# EAGLE schematic version_1_1 (EAGLE 7.6.0)
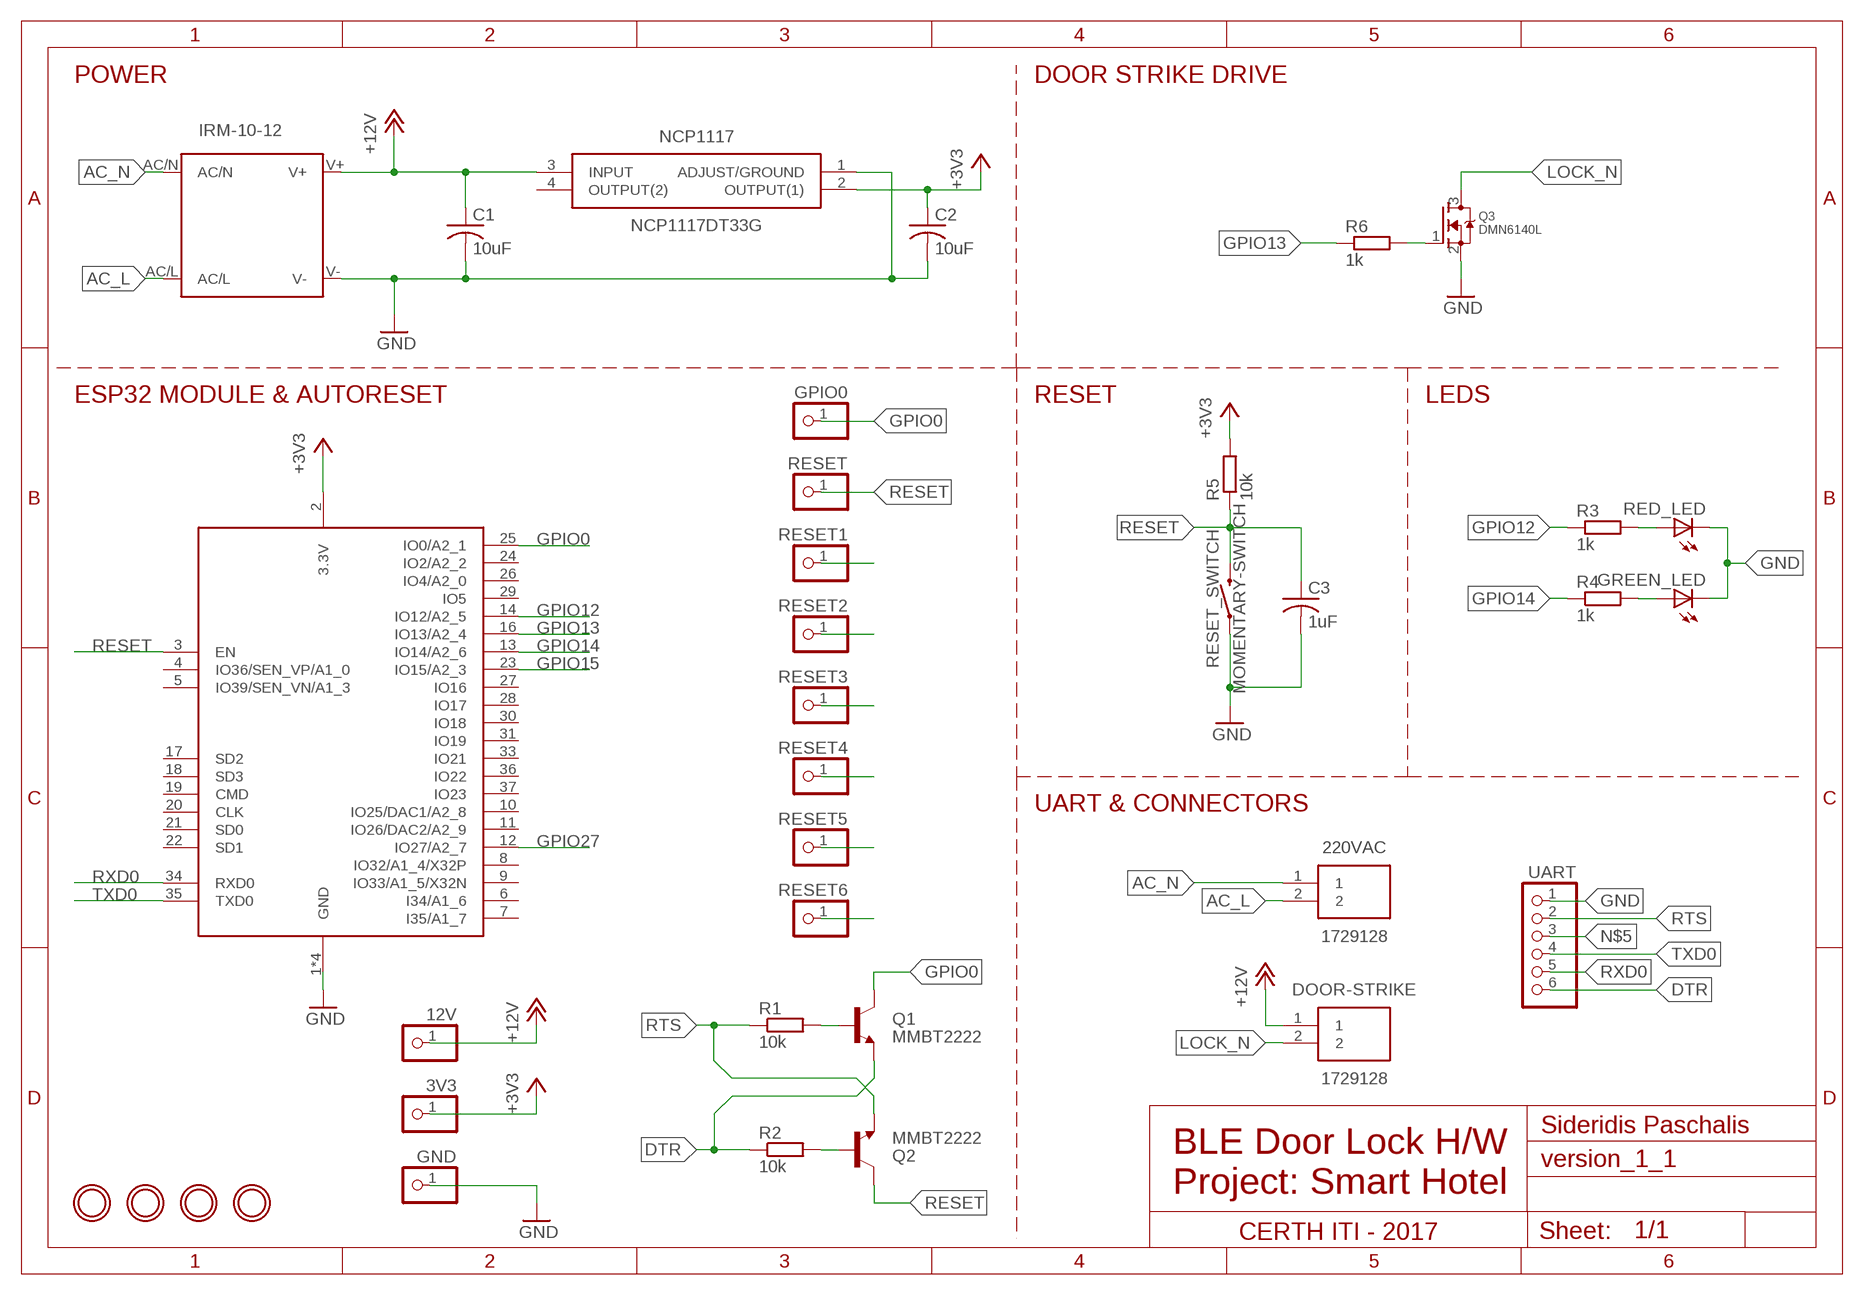
[diagram p0: schematic, sheet 1]

## Parts
3V3  PINHD-1X1  [1X01]
12V  PINHD-1X1  [1X01]
220VAC  1729128  [HDRV2W110P0X508_1X2_1016X810X1]
C1  10uF  C-USC0805  [C0805]
C2  10uF  C-USC0805  [C0805]
C3  1uF  C-USC0805  [C0805]
DOOR-STRIKE  1729128  [HDRV2W110P0X508_1X2_1016X810X1]
ESP32  ESP32_WROOM32_SKINNY  [WROOM32_SKINNY]
GND  PINHD-1X1  [1X01]
GPIO0  PINHD-1X1  [1X01]
GREEN_LED  LED5MM  [LED5MM]
IRM-10-12  IRM_05/10  [IRM_05/10]
NCP1117  NCP1117DT33G  [TO229P990X238-4N]
Q1  MMBT2222  TRANSISTOR_NPNSOT23  [SOT23]
Q2  MMBT2222  TRANSISTOR_NPNSOT23  [SOT23]
Q3  DMN6140L  MOSFET-NREFLOW  [SOT23]
R1  10k  R-EU_R0805  [R0805]
R2  10k  R-EU_R0805  [R0805]
R3  1k  R-EU_R0805  [R0805]
R4  1k  R-EU_R0805  [R0805]
R5  10k  R-EU_R0805  [R0805]
R6  1k  R-EU_R0805  [R0805]
RED_LED  LED5MM  [LED5MM]
RESET  PINHD-1X1  [1X01]
RESET1  PINHD-1X1  [1X01]
RESET2  PINHD-1X1  [1X01]
RESET3  PINHD-1X1  [1X01]
RESET4  PINHD-1X1  [1X01]
RESET5  PINHD-1X1  [1X01]
RESET6  PINHD-1X1  [1X01]
RESET_SWITCH  MOMENTARY-SWITCH  MOMENTARY-SWITCH-SPST-SMD-6.2MM-TALL  [TACTILE_SWITCH_SMD_6.2MM_TALL]
U$1  MOUNTINGHOLE2.5  [MOUNTINGHOLE_2.5_PLATED]
U$2  MOUNTINGHOLE2.5  [MOUNTINGHOLE_2.5_PLATED]
U$3  MOUNTINGHOLE2.5  [MOUNTINGHOLE_2.5_PLATED]
U$4  MOUNTINGHOLE2.5  [MOUNTINGHOLE_2.5_PLATED]
UART  PINHD-1X6  [1X06]

## Nets
+3V3: 3V3.1 C2.1 ESP32.2(3.3V) NCP1117.2(OUTPUT(1)) R5.2
+12V: 12V.1 C1.1 DOOR-STRIKE.1 IRM-10-12.V+ NCP1117.3(INPUT)
AC_L: 220VAC.2 IRM-10-12.AC/L
AC_N: 220VAC.1 IRM-10-12.AC/N
DTR: Q1.2(E) R2.1 UART.6
GND: C1.2 C2.2 C3.2 ESP32.1(GND) ESP32.15(GND) ESP32.38(GND) ESP32.P$1(GND) GND.1 GREEN_LED.K(C) IRM-10-12.V- NCP1117.1(ADJUST/GROUND) Q3.2(S) RED_LED.K(C) RESET_SWITCH.A2 UART.1
GPIO0: ESP32.25(IO0/A2_1) GPIO0.1 Q1.3(C)
GPIO12: ESP32.14(IO12/A2_5) R3.1
GPIO13: ESP32.16(IO13/A2_4) R6.1
GPIO14: ESP32.13(IO14/A2_6) R4.1
GPIO15: ESP32.23(IO15/A2_3)
GPIO27: ESP32.12(IO27/A2_7)
LOCK_N: DOOR-STRIKE.2 Q3.3(D)
N$1: R3.2 RED_LED.A
N$2: Q1.1(B) R1.2
N$3: Q2.1(B) R2.2
N$4: GREEN_LED.A R4.2
N$5: UART.3
N$6: Q3.1(G) R6.2
N$7: RESET1.1
N$8: RESET2.1
N$9: RESET3.1
N$10: RESET4.1
N$11: RESET5.1
N$12: RESET6.1
RESET: C3.1 ESP32.3(EN) Q2.3(C) R5.1 RESET.1 RESET_SWITCH.B2
RTS: Q2.2(E) R1.1 UART.2
RXD0: ESP32.34(RXD0) UART.5
TXD0: ESP32.35(TXD0) UART.4
Unconnected: ESP32.4(IO36/SEN_VP/A1_0) ESP32.5(IO39/SEN_VN/A1_3) ESP32.6(I34/A1_6) ESP32.7(I35/A1_7) ESP32.8(IO32/A1_4/X32P) ESP32.9(IO33/A1_5/X32N) ESP32.10(IO25/DAC1/A2_8) ESP32.11(IO26/DAC2/A2_9) ESP32.17(SD2) ESP32.18(SD3) ESP32.19(CMD) ESP32.20(CLK) ESP32.21(SD0) ESP32.22(SD1) ESP32.24(IO2/A2_2) ESP32.26(IO4/A2_0) ESP32.27(IO16) ESP32.28(IO17) ESP32.29(IO5) ESP32.30(IO18) ESP32.31(IO19) ESP32.33(IO21) ESP32.36(IO22) ESP32.37(IO23) NCP1117.4(OUTPUT(2))

## Notes on the sheet
- POWER | DOOR STRIKE DRIVE
- ESP32 MODULE & AUTORESET | RESET | LEDS
- UART & CONNECTORS
- Sideridis Paschalis
- BLE Door Lock H/W
  Project: Smart Hotel
- CERTH ITI - 2017

## Library data of the parts
3V3 12V GND GPIO0 RESET RESET1-RESET6 = adafruit:PINHD-1X1: Pin header 1x1 for 0.1" spacing With round pins
220VAC DOOR-STRIKE = 1729128:1729128: 2way low profile vertical mount terminal Phoenix Contact Non-Fused Terminal Block, 2 Way, Solder Terminals, 30 ??? 14 AWG Through Hole, Nylon, 630 V <https://componentsearchengine.com/Images/1/1729128.jpg> Source: Datasheet <http://docs-europe.electrocomponents.com/webdocs/1380/0900766b81380189.pdf>; ALLIED_NUMBER: 70054405; DESCRIPTION: 2way low profile vertical mount terminal Phoenix Contact Non-Fused Terminal Block, 2 Way, Solder Terminals, 30 ??? 14 AWG Through Hole, Nylon, 630 V; HEIGHT: 10mm; MANUFACTURER_NAME: Phoenix Contact; MANUFACTURER_PART_NUMBER: 1729128; RS_PART_NUMBER: 1930586; SUPPLIER_NAME: RS
C1-C3 = rcl:C-US: CAPACITOR, American symbol
ESP32 = Adafruit HUZZAH32 ESP32 Feather:ESP32_WROOM32
GREEN_LED RED_LED = adafruit:LED: LED OSRAM: - CHIPLED LG R971, LG N971, LY N971, LG Q971, LY Q971, LO R971, LY R971 LH N974, LH R974 LS Q976, LO Q976, LY Q976 LO Q996 - Hyper CHIPLED LW Q18S LB Q993, LB Q99A, LB R99A - SideLED LS A670, LO A670, LY A670, LG A670, LP A670 LB A673, LV A673, LT A673, LW A673 LH A674 LY A675 LS A676, LA A676, LO A676, LY A676, LW A676 LS A679, LY A679, LG A679 - Hyper Micro SIDELED® LS Y876, LA Y876, LO Y876, LY Y876 LT Y87S - SmartLED LW L88C, LW L88S LB L89C, LB L89S, LG L890 LS L89K, LO L89K, LY L89K LS L896, LA L896, LO L896, LY L896 - TOPLED LS T670, LO T670, LY T670, LG T670, LP T670 LSG T670, LSP T670, LSY T670, LOP T670, LYG T670 LG T671, LOG T671, LSG T671 LB T673, LV T673, LT T673, LW T673 LH T674 LS T676, LA T676, LO T676, LY T676, LB T676, LH T676, LSB T676, LW T676 LB T67C, LV T67C, LT T67C, LS T67K, LO T67K, LY T67K, LW E67C LS E67B, LA E67B, LO E67B, LY E67B, LB E67C, LV E67C, LT E67C LW T67C LS T679, LY T679, LG T679 LS T770, LO T770, LY T770, LG T770, LP T770 LB T773, LV T773, LT T773, LW T773 LH T774 LS E675, LA E675, LY E675, LS T675 LS T776, LA T776, LO T776, LY T776, LB T776 LHGB T686 LT T68C, LB T68C - Hyper Mini TOPLED® LB M676 - Mini TOPLED Santana® LG M470 LS M47K, LO M47K, LY M47K Source: http://www.osram.convergy.de/
IRM-10-12 = meanwell_irm_v5:IRM_05/10: 5 or 10 watt housing & pin compatible IRM 05 Vout [V] Imax [A] Pmax [W] Eff [%] 3.3 1.25 4.125 68 5 1 5 71 12 0.42 5.04 75 15 0.33 4.95 75 24 0.23 5.52 77 IRM 10 Vout [V] Imax [A] Pmax [W] Eff [%] 3.3 2.5 8.25 74 5 2 10 77 12 0.85 10.2 82 15 0.67 10.05 82 24 0.42 10.08 82
NCP1117 = NCP1117DT33G:NCP1117DT33G: 1A,3.3V,LDO Voltage Reg.,NCP1117DT33 NCP1117DT33G, Low Dropout Voltage Regulator, 1A, 3.3 V 1%, 3-Pin DPAK <https://componentsearchengine.com/Images/3/NCP1117DT33G.jpg> Source: Datasheet <http://www.onsemi.com/pub/Collateral/NCP1117-D.PDF>; ALLIED_NUMBER: 70340549; DESCRIPTION: 1A,3.3V,LDO Voltage Reg.,NCP1117DT33 NCP1117DT33G, Low Dropout Voltage Regulator, 1A, 3.3 V 1%, 3-Pin DPAK; HEIGHT: 2.38mm; MANUFACTURER_NAME: ON Semiconductor; MANUFACTURER_PART_NUMBER: NCP1117DT33G; RS_PART_NUMBER: 1023504; SUPPLIER_NAME: RS
Q1 Q2 = Adafruit HUZZAH32 ESP32 Feather:TRANSISTOR_NPN: Transistor NPN BJT configuration in SOT23 package. MMBT2222 is the common NPN we use. Double check BCE configuration again layout.
Q3 = adafruit:MOSFET-N: N-Channel Mosfet 2N7002E - 60V 260mA SOT23 [Digikey: 2N7002ET1GOSTR-ND] - REEL BSH103 - 30V 850mA SOT23 [Digikey: 568-5013-1-ND]
R1-R6 = rcl:R-EU_: RESISTOR, European symbol
RESET_SWITCH = SparkFun-Switches:MOMENTARY-SWITCH-SPST: Momentary Switch (Pushbutton) - SPST Normally-open (NO) SPST momentary switches (buttons, pushbuttons). Variants PTH-12MM - 12mm square, through-hole Momentary Pushbutton Switch - 12mm Square <https://www.sparkfun.com/products/9190> (COM-09190) PTH-6.0MM, PTH-6.0MM-KIT - 6.0mm square, through-hole Mini Pushbutton Switch <https://www.sparkfun.com/products/97> (COM-00097) KIT package intended for soldering kit's - only one side of pads' copper is exposed. PTH-RIGHT-ANGLE-KIT - Right-angle, through-hole Right Angle Tactile Button <https://www.sparkfun.com/products/10791> - Used on SparkFun BigTime Watch Kit <https://www.sparkfun.com/products/11734> SMD-12MM - 12mm square, surface-mount Tactile Button - SMD (12mm) <https://www.sparkfun.com/products/12993> (COM-12993) Used on SparkFun PicoBoard <https://www.sparkfun.com/products/11888> SMD-4.5MM - 4.5mm Square Trackball Switch Used on SparkFun Blackberry Trackballer Breakout <https://www.sparkfun.com/products/13169> SMD-4.6MMX2.8MM - 4.60mm x 2.80mm, surface mount Used on SparkFun SAMD21 Mini Breakout <https://www.sparkfun.com/products/13664> SMD-5.2MM, SMD-5.2-REDUNDANT - 5.2mm square, surface-mount Mini Pushbutton Switch - SMD <https://www.sparkfun.com/products/8720> (COM-08720) Used on Arduino Pro Mini <https://www.sparkfun.com/products/11114> REDUNDANT package connects both switch circuits together SMD-6.0X3.5MM - 6.0 x 3.5mm, surface mount Momentary Reset Switch SMD <https://www.sparkfun.com/products/8229> (COM-08229) SMD-6.2MM-TALL - 6.2mm square, surface mount Tactile Button - SMD (6mm) <https://www.sparkfun.com/products/12992> Used on SparkFun Digital Sandbox <https://www.sparkfun.com/products/12651> SMD-RIGHT-ANGLE - Right-angle, surface mount Used on SparkFun Block for Intel® Edison - Arduino <https://www.sparkfun.com/products/13036>; PROD_ID: SWCH-11966; SF_SKU: COM-12992
U$1-U$4 = Adafruit HUZZAH32 ESP32 Feather:MOUNTINGHOLE: Mounting Hole For #2 screws (0.086"/2.18mm width, 0.094"/2.4mm hole) use 2.5mm; BOM: EXCLUDE
UART = adafruit:PINHD-1X6: PIN HEADER